# Altium schematic sheet COURONNE PARTIE I SCHEMA.SchDoc
size A4
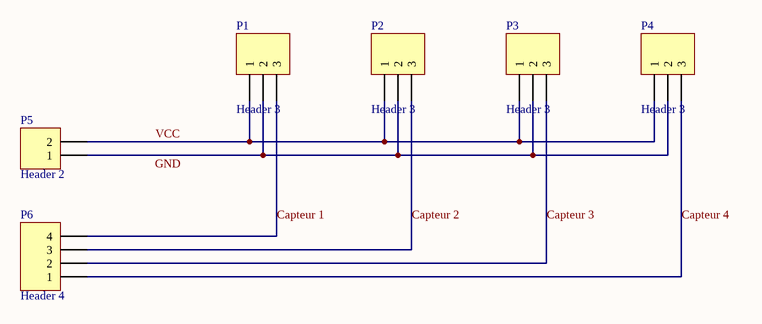
[diagram p0: COURONNE PARTIE I SCHEMA.SchDoc]

## Parts
P1  Header 3  [HDR1X3]
P2  Header 3  [HDR1X3]
P3  Header 3  [HDR1X3]
P4  Header 3  [HDR1X3]
P5  Header 2  [HDR1X2]
P6  Header 4  [HDR1X4]

## Nets
Capteur 1: P1.3 P6.4
Capteur 2: P2.3 P6.3
Capteur 3: P3.3 P6.2
Capteur 4: P4.3 P6.1
GND: P1.2 P2.2 P3.2 P4.2 P5.1
VCC: P1.1 P2.1 P3.1 P4.1 P5.2

## Library data of the parts
P1-P4 = Header 3: Header, 3-Pin; LatestRevisionDate: 17-Jul-2002; LatestRevisionNote: Re-released for DXP Platform.; Publisher: Altium Limited
P5 = Header 2: Header, 2-Pin; LatestRevisionDate: 17-Jul-2002; LatestRevisionNote: Re-released for DXP Platform.; Publisher: Altium Limited
P6 = Header 4: Header, 4-Pin; LatestRevisionDate: 17-Jul-2002; LatestRevisionNote: Re-released for DXP Platform.; Publisher: Altium Limited